# EAGLE design Test_Motorboard (EAGLE 7.7.0)
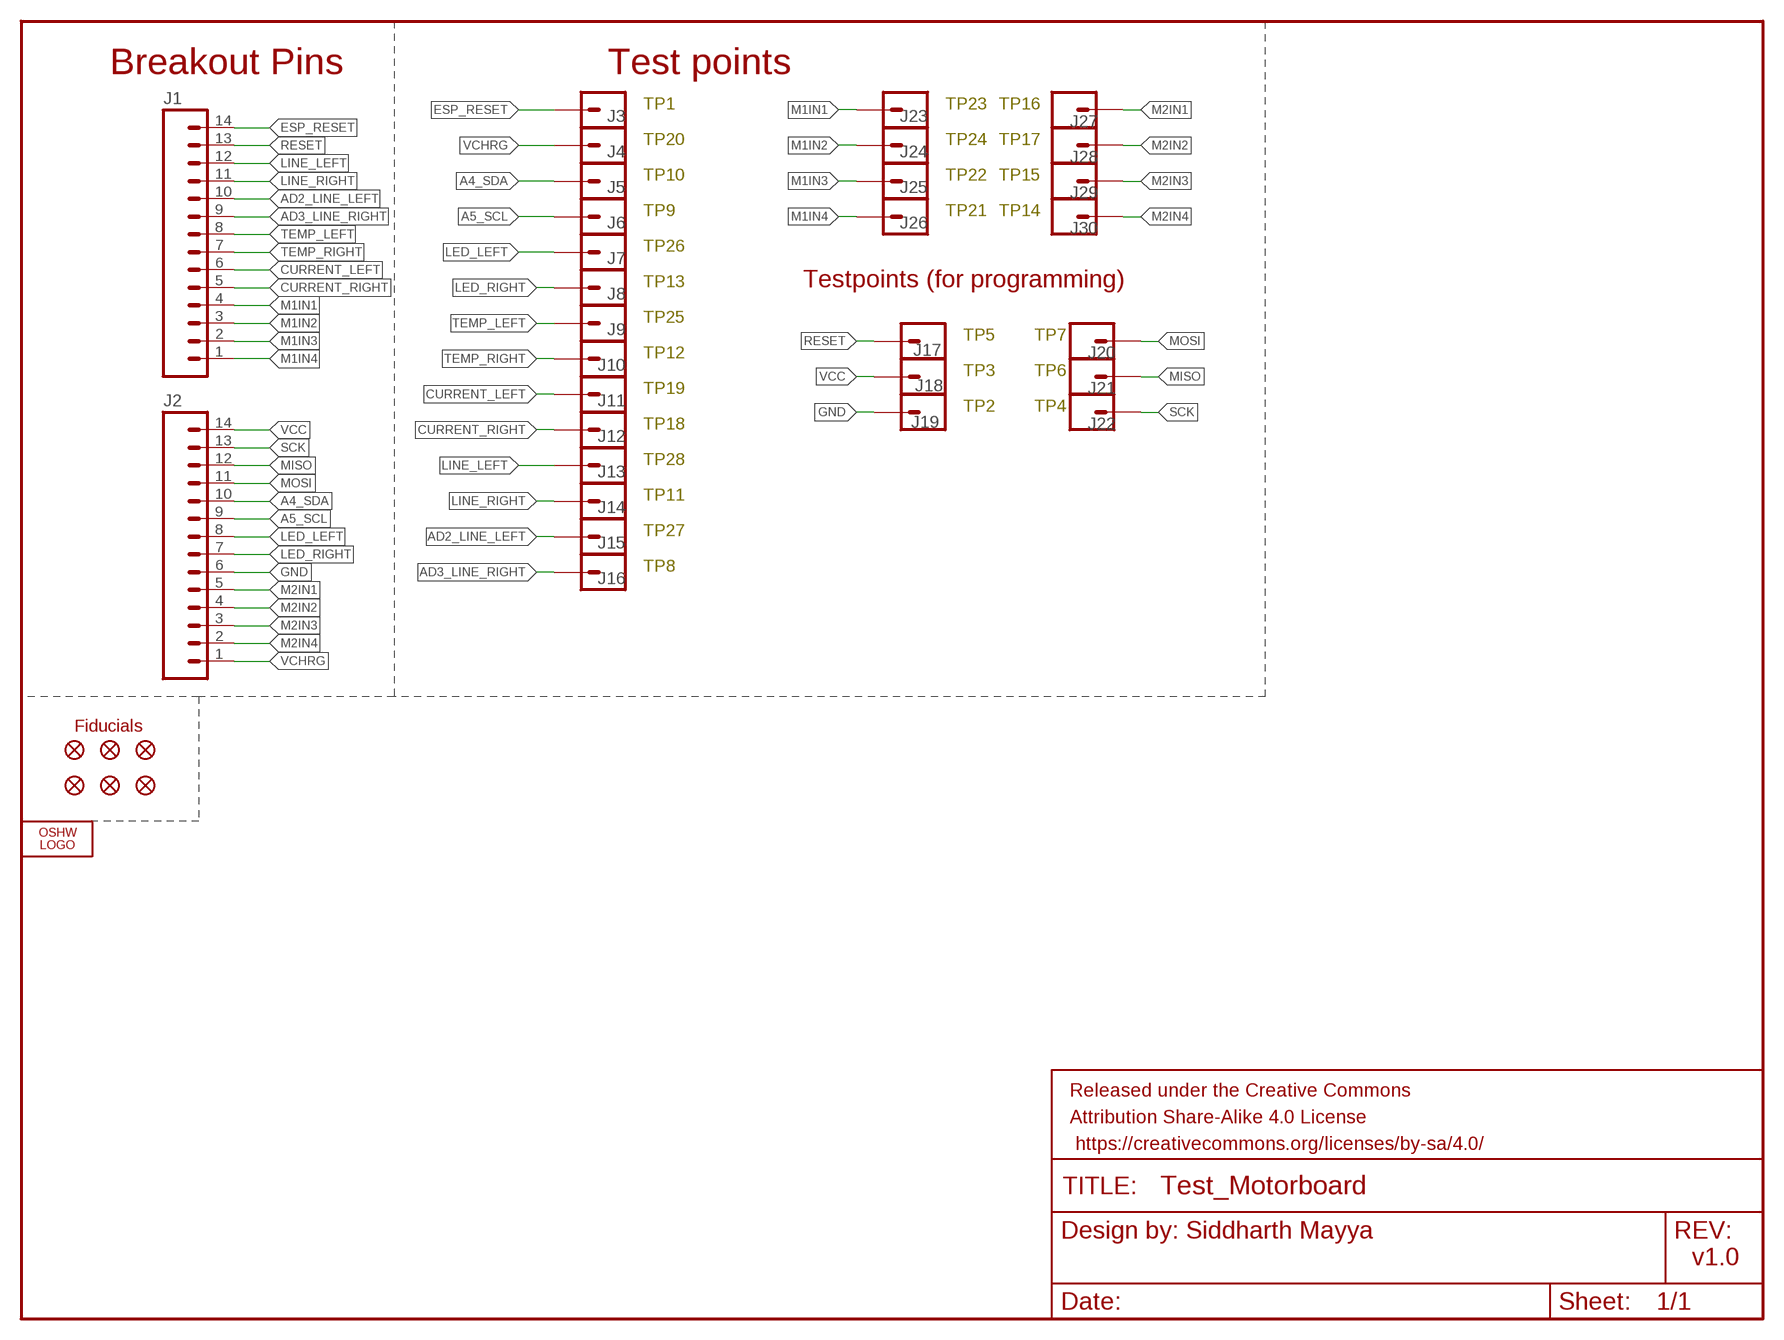
[diagram p0: schematic, sheet 1]

## Parts
FD1  FIDUCIAL1X2  [FIDUCIAL-1X2]
FD2  FIDUCIAL1X2  [FIDUCIAL-1X2]
FD3  FIDUCIAL1X2  [FIDUCIAL-1X2]
FD4  FIDUCIAL1X2  [FIDUCIAL-1X2]
FD5  FIDUCIAL1X2  [FIDUCIAL-1X2]
FD6  FIDUCIAL1X2  [FIDUCIAL-1X2]
FRAME1  FRAME-LETTER  [CREATIVE_COMMONS]
J1  M14  [1X14]
J2  M14  [1X14]
J3  M01PTH  [1X01]
J4  M01PTH  [1X01]
J5  M01PTH  [1X01]
J6  M01PTH  [1X01]
J7  M01PTH  [1X01]
J8  M01PTH  [1X01]
J9  M01PTH  [1X01]
J10  M01PTH  [1X01]
J11  M01PTH  [1X01]
J12  M01PTH  [1X01]
J13  M01PTH  [1X01]
J14  M01PTH  [1X01]
J15  M01PTH  [1X01]
J16  M01PTH  [1X01]
J17  M01PTH  [1X01]
J18  M01PTH  [1X01]
J19  M01PTH  [1X01]
J20  M01PTH  [1X01]
J21  M01PTH  [1X01]
J22  M01PTH  [1X01]
J23  M01PTH  [1X01]
J24  M01PTH  [1X01]
J25  M01PTH  [1X01]
J26  M01PTH  [1X01]
J27  M01PTH  [1X01]
J28  M01PTH  [1X01]
J29  M01PTH  [1X01]
J30  M01PTH  [1X01]
LOGO1  OSHW_LOGO_FILLX0100-NT  [OSHW_FILLX100_NOTEXT]

## Nets
A4_SDA: J2.10 J5.1
A5_SCL: J2.9 J6.1
AD2_LINE_LEFT: J1.10 J15.1
AD3_LINE_RIGHT: J1.9 J16.1
CURRENT_LEFT: J1.6 J11.1
CURRENT_RIGHT: J1.5 J12.1
ESP_RESET: J1.14 J3.1
GND: J2.6 J19.1
LED_LEFT: J2.8 J7.1
LED_RIGHT: J2.7 J8.1
LINE_LEFT: J1.12 J13.1
LINE_RIGHT: J1.11 J14.1
M1IN1: J1.4 J23.1
M1IN2: J1.3 J24.1
M1IN3: J1.2 J25.1
M1IN4: J1.1 J26.1
M2IN1: J2.5 J27.1
M2IN2: J2.4 J28.1
M2IN3: J2.3 J29.1
M2IN4: J2.2 J30.1
MISO: J2.12 J21.1
MOSI: J2.11 J20.1
RESET: J1.13 J17.1
SCK: J2.13 J22.1
TEMP_LEFT: J1.8 J9.1
TEMP_RIGHT: J1.7 J10.1
VCC: J2.14 J18.1
VCHRG: J2.1 J4.1

## Notes on the sheet
- Breakout Pins | Test points
- TP1 | TP23 | TP16
- TP20 | TP24 | TP17
- TP10 | TP22 | TP15
- TP9 | TP21 | TP14
- TP26
- TP13 | Testpoints (for programming)
- TP25
- TP5 | TP7
- TP12
- TP3 | TP6
- TP19
- TP2 | TP4
- TP18
- TP28
- TP11
- TP27
- TP8
- Fiducials
- v1.0

## Library data of the parts
FD1-FD6 = SparkFun-Aesthetics:FIDUCIAL: Fiducial Alignment Points Various fiducial points for machine vision alignment.
FRAME1 = GRITSBot:FRAME-LETTER: Schematic Frame Standard 8.5x11 US Letter frame
J1 J2 = SparkFun-Connectors:M14: Header 14 Standard 14-pin 0.1" header. Use with straight break away headers (SKU : PRT-00116), right angle break away headers (PRT-00553), swiss pins (PRT-00743), machine pins (PRT-00117), and female headers (PRT-00115).
J3-J30 = GRITSBot:M01: Header 1 Standard 1-pin 0.1" header. Use with straight break away headers (SKU : PRT-00116), right angle break away headers (PRT-00553), swiss pins (PRT-00743), machine pins (PRT-00117), and female headers (PRT-00115). SMTSO-256-ET is a "flush mount" nut for a 4-40 screw. The older package used to be too tight, and did not allow it to sit properly thru the drill hit. The latest (0.165DIA) fits nice and snug.
LOGO1 = OSHW:OSHW_LOGO_FILL

## Net classes
1 power: width 0.381 mm, clearance 0.254 mm

## Board
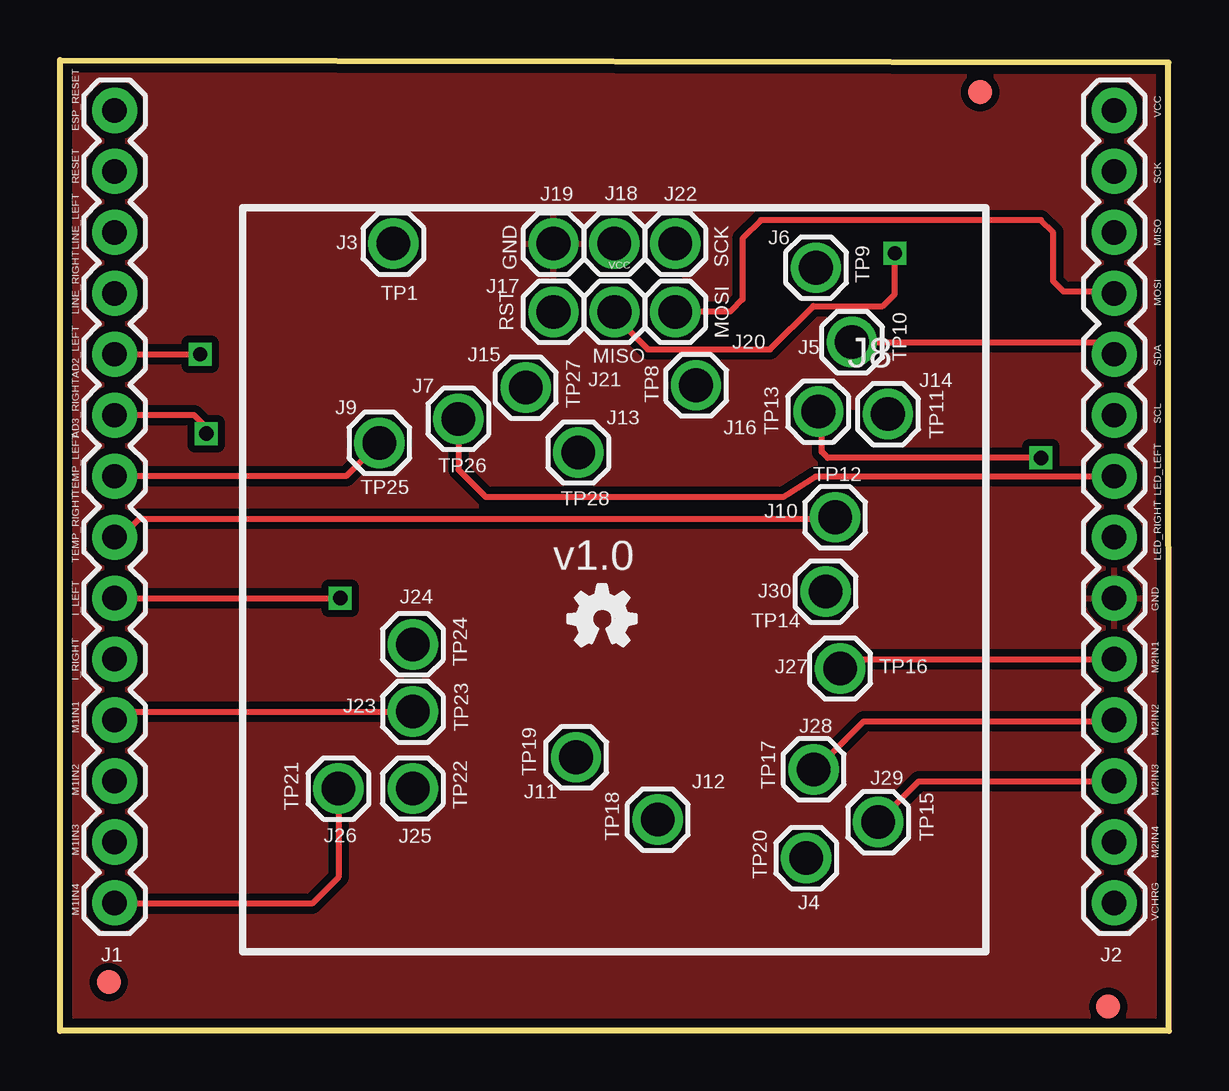
[diagram p1: board, top side]
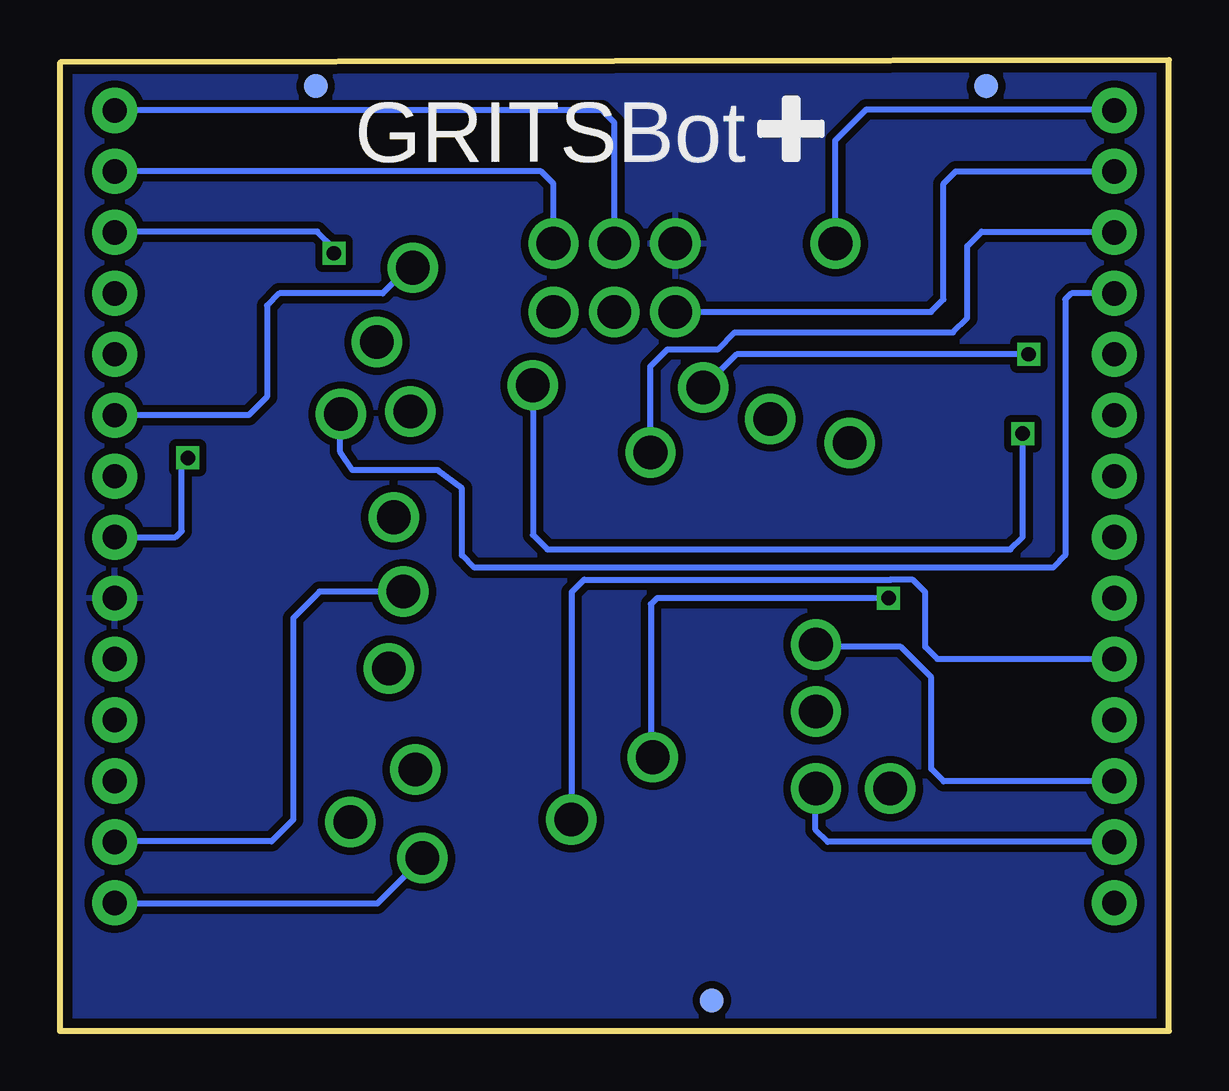
[diagram p2: board, bottom side, seen from below]

Size 46.22 x 40.46 mm. Coordinates in mm from the lower left corner, seen from the top.
Outline: 0,0 0,40.46 46.2,40.36 46.22,0 0,0
Copper layers (1*16): Top 0.0356mm / dielectric 1.5011mm / Bottom 0.0356mm
Design rules "default": minimum track width 6mil, minimum drill 13mil, track to track 6mil, track to pad 6mil, pad to pad 6mil, via to via 6mil, smd to smd 6mil, copper to edge 15mil, drill to drill 6mil, minimum pad ring 7mil, minimum via ring 7mil, stop-mask expansion 3mil, vias tented up to drill 40mil, thermal gap 10mil

### Footprints (pad centres in the part's own frame; a part is rotated, then mirrored left to right if it is on the bottom)
FIDUCIAL-1X2 = smd 1 x 1: 1 0,0
1X14 = drill 1.016 pad 1.88: 1 0,0; 2 2.54,0; 3 5.08,0; 4 7.62,0; 5 10.16,0; 6 12.7,0; 7 15.24,0; 8 17.78,0; 9 20.32,0; 10 22.86,0; 11 25.4,0; 12 27.94,0; 13 30.48,0; 14 33.02,0
1X01 = drill 1.4 pad 1.93: 1 0,0

### Placement (x,y rotation side)
FD1  2.03,2.03 0 top
FD2  43.69,1.02 0 top
FD3  38.35,39.12 0 top
FD4  19.05,1.27 0 bottom
FD5  7.62,39.37 0 bottom
FD6  35.56,39.37 0 bottom
FRAME1  7.61,3.3 0 top
FRAME3  FRAME-LETTER  [CREATIVE_COMMONS]  7.61,3.3 0 top
J1  2.28,5.33 90 top
J2  43.94,5.33 90 top
J3  13.9,32.8 0 top
J4  31.11,7.2 0 top
J5  33.01,28.7 0 top
J6  31.51,31.8 0 top
J7  16.61,25.5 0 top
J8  31.61,25.8 0 top
J9  13.31,24.5 0 top
J10  32.31,21.4 0 top
J11  21.51,11.4 0 top
J12  24.91,8.8 0 top
J13  21.61,24.1 0 top
J14  34.51,25.7 0 top
J15  19.41,26.8 0 top
J16  26.51,26.9 0 top
J17  20.57,29.96 0 top
J18  23.11,32.8 0 top
J19  20.57,32.8 0 top
J20  25.65,29.96 0 top
J21  23.11,29.96 0 top
J22  25.65,32.8 0 top
J23  14.71,13.3 0 top
J24  14.71,16.1 0 top
J25  14.71,10.1 0 top
J26  11.61,10.1 0 top
J27  32.51,15.1 0 top
J28  31.41,10.9 0 top
J29  34.11,8.7 0 top
J30  31.91,18.3 0 top
LOGO1  21.19,16.04 0 top

### Tracks (layer width: path | path; a pad name or v marks a point on that pad's centre or on a via)
A4_SDA
  Top 0.254: J5.1 43.43,28.7 J2.10
A5_SCL
  Bottom 0.254: 43.88,25.6 J2.9 38.35,25.65 37.59,26.42 37.59,30.23 37.08,30.73 32.77,30.73 31.7,31.8 J6.1
AD2_LINE_LEFT  (via drill 0.6)
  Top 0.254: v5.84,28.19 5.83,28.2 2.29,28.2 J1.10
  Bottom 0.254: v5.84,28.19 18.02,28.19 J15.1
AD3_LINE_RIGHT  (via drill 0.6)
  Top 0.254: v6.1,24.89 6.1,25.15 5.59,25.65 J1.9
  Bottom 0.254: J16.1 26.51,20.67 25.91,20.07 6.6,20.07 6.1,20.57 v6.1,24.89
CURRENT_LEFT  (via drill 0.6)
  Top 0.254: J1.6 v11.68,18.03
  Bottom 0.254: v11.68,18.03 21.34,18.03 21.59,17.78 21.59,11.48 J11.1
CURRENT_RIGHT
  Bottom 0.254: J1.5 2.29,15.5 9.66,15.5 10.16,16 10.16,18.29 10.67,18.8 11.6,18.8 24.38,18.8 24.89,18.29 24.89,8.82 J12.1
ESP_RESET
  Bottom 0.254: J3.1 13.9,37.1 12.6,38.4 2.33,38.4 J1.14
GND
  pour Bottom (isolate 0.305): 0,40.46 0,0 46.23,0 46.25,17.55 46.2,40.36
  pour Top (isolate 0.305): 0,40.46 0,0 46.2,0 46.2,40.36
LED_LEFT
  Top 0.254: J7.1 16.61,23.39 17.75,22.26 30.15,22.26 31.5,23.1 43.92,23.1 J2.8
LED_RIGHT  (via drill 0.6)
  Top 0.254: v40.89,23.88 32,23.88 31.75,24.13 31.75,25.67 J8.1
  Bottom 0.254: J2.7 41.4,20.57 41.15,20.83 41.15,23.62 v40.89,23.88
LINE_LEFT
  Bottom 0.254: J13.1 21.61,27.69 20.9,28.4 18.8,28.4 18.1,29.1 9,29.1 8.4,29.7 8.4,32.7 7.8,33.3 2.31,33.3 J1.12
LINE_RIGHT
  Bottom 0.254: J1.11 4.06,30.73 4.32,30.48 4.32,19.81 4.83,19.3 28.96,19.3 29.46,19.81 29.46,22.61 30.48,23.37 34.04,23.37 34.54,24.13 34.54,25.67 J14.1
M1IN1
  Top 0.254: J1.4 2.63,13.3 J23.1
M1IN2
  Bottom 0.254: J1.3 9.39,10.4 9.91,10.92 9.91,14.73 11.18,16 14.61,16 J24.1
M1IN3
  Bottom 0.254: J1.2 14.22,7.87 14.73,8.38 14.73,10.08 J25.1
M1IN4
  Top 0.254: J26.1 11.61,6.41 10.5,5.3 2.31,5.3 J1.1
M2IN1
  Top 0.254: 43.93,15.5 J2.5 33.02,15.49 32.63,15.1 J27.1
M2IN2
  Top 0.254: J28.1 31.5,10.9 33.5,12.9 43.88,12.9 J2.4
M2IN3
  Top 0.254: J29.1 34.11,8.71 35.8,10.4 43.92,10.4 J2.3
M2IN4
  Bottom 0.254: J30.1 35.4,18.3 36.5,17.2 36.5,8.8 37.4,7.9 43.91,7.9 J2.2
MISO  (via drill 0.6)
  Top 0.254: J21.1 23.11,29.79 24.5,28.4 29.6,28.4 31.4,30.2 34.3,30.2 34.8,30.7 v34.8,32.4
  Bottom 0.254: v34.8,32.4 34.8,32.6 35.5,33.3 43.91,33.3 J2.12
MOSI
  Top 0.254: 25.65,30.05 J20.1 25.66,29.97 27.94,29.97 28.45,30.48 28.45,33.02 29.21,33.78 40.89,33.78 41.4,33.27 41.4,31.24 41.84,30.8 43.87,30.8 J2.11
RESET
  Bottom 0.254: J17.1 9.92,29.96 9.4,30.48 9.4,35.31 8.89,35.81 J1.13
SCK
  Bottom 0.254: J2.13 43.41,35.8 43.4,35.81 26.16,35.81 25.65,35.3 J22.1
TEMP_LEFT
  Top 0.254: J9.1 11.93,23.11 J1.8
TEMP_RIGHT
  Top 0.254: J1.7 2.54,20.57 3.3,21.34 32.24,21.34 J10.1
VCC
  Bottom 0.254: J18.1 23.11,37.84 23.62,38.35 J2.14
VCHRG
  Bottom 0.254: J4.1 33,5.3 43.9,5.3 J2.1

### Text on the board
tPlace: ESP_RESET | VCC | RESET | SCK | GND | SCK | LINE_LEFT | MISO | VCC | TP9 | LINE_RIGHT | TP1 | MOSI | RST | MOSI | MISO | TP10 | SDA | AD2_LEFT | TP27 | TP8 | AD3_RIGHT | TP13 | TP11 | SCL | TP26 | TP12 | TEMP_LEFT | TP25 | TP28 | LED_LEFT | TEMP_RIGHT | LED_RIGHT | v1.0 | GND | I_LEFT | TP14 | I_RIGHT | TP24 | TP16 | M2IN1 | M1IN1 | TP23 | M2IN2 | TP19 | M1IN2 | TP17 | M2IN3 | TP21 | TP22 | TP18 | TP15 | M1IN3 | M2IN4 | TP20 | M1IN4 | VCHRG
bPlace: GRITSBot
tDocu: TODO: / - Make sure all silk screen labels are at least of size 0.6096 / - This is cosmetic but make sure the positions and lengths are round / numbers in mm / - Again cosmetic, but make sure traces only run at 45 degree angles / (or horizontal or vertical) / - Make sure vias are round and of size 0.381 (min. size Oshpark can do) | Released under the Creative Commons Attribution Share-Alike 4.0 License / https://creativecommons.org/licenses/by-sa/4.0/ | Designed by: Siddharth Mayya at the GRITSLab at Georgia Tech (http://gritslab.gatech.edu)